# Altium schematic sheet Controller.SchDoc
size A4; Date: Date; CompanyName: HESSO; Engineer: Name; Address1: Route du Rawyl 47; Address2: 1950 Sion; Address3: Switzerland; DocumentNumber: 3; SheetNumber: 1; SheetTotal: 4; ProjectName: Project Name
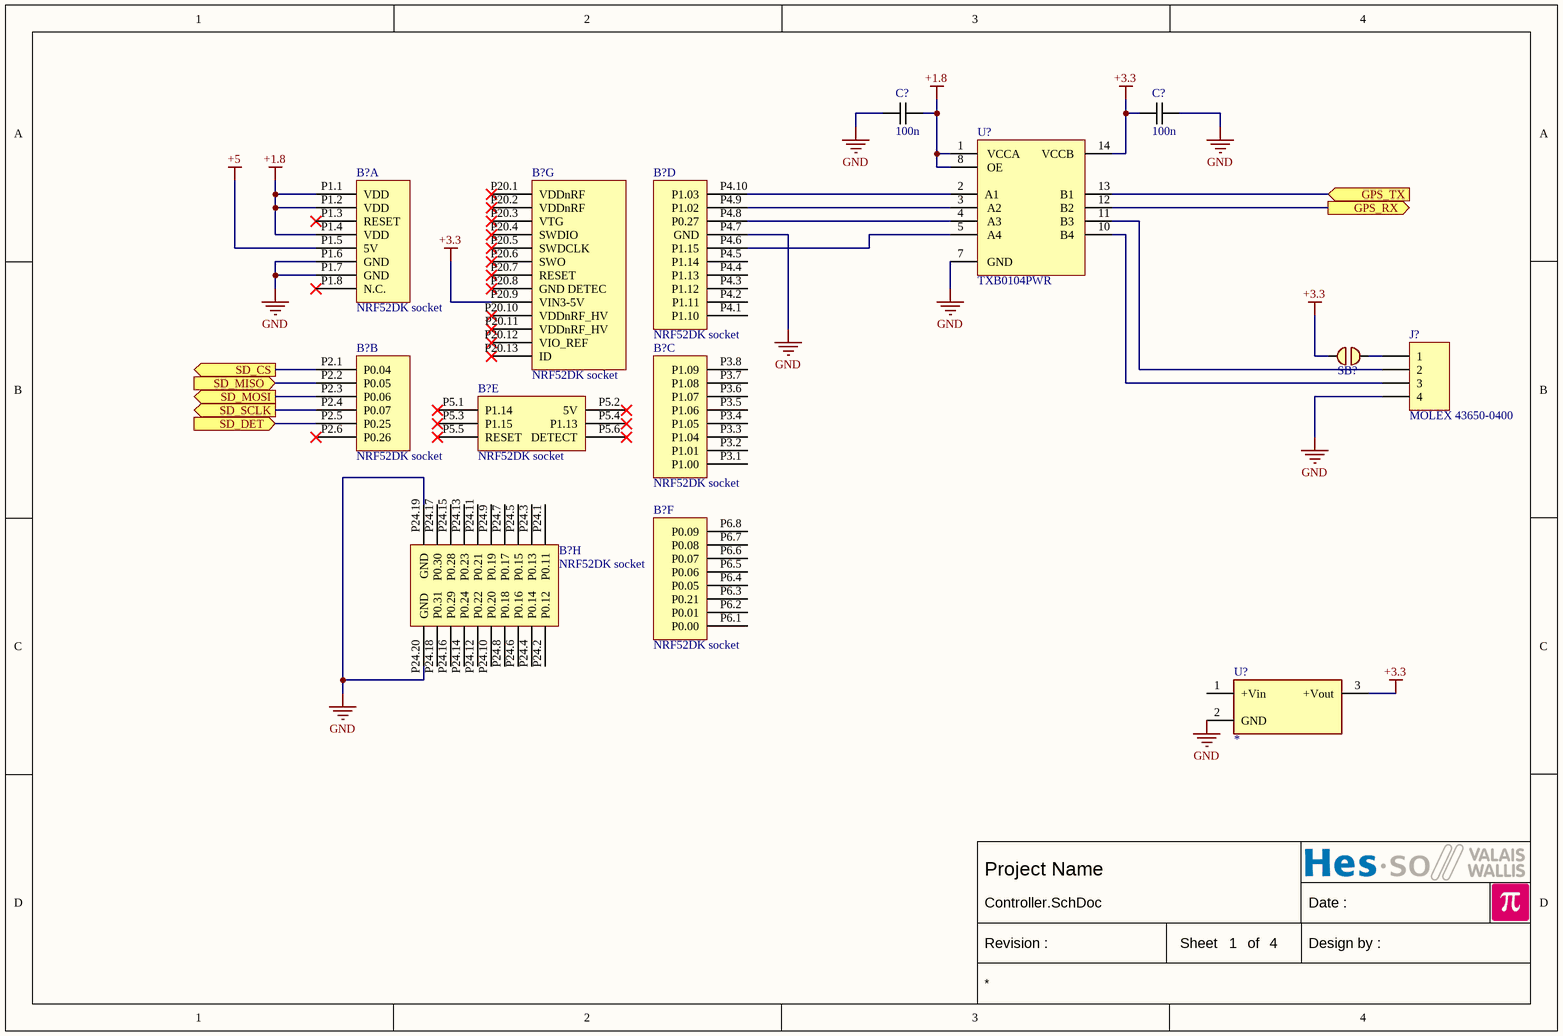
[diagram p0: Controller.SchDoc]

## Parts
(Parts that share a designator on the sheet are numbered #1, #2 ... from top to bottom, then left to right.)
B?#1  NRF52DK socket  [nRF5340DK SOCKET]  (part A of 8)
B?#2  NRF52DK socket  [nRF5340DK SOCKET]  (part G of 8)
B?#3  NRF52DK socket  [nRF5340DK SOCKET]  (part D of 8)
B?#4  NRF52DK socket  [nRF5340DK SOCKET]  (part B of 8)
B?#5  NRF52DK socket  [nRF5340DK SOCKET]  (part E of 8)
B?#6  NRF52DK socket  [nRF5340DK SOCKET]  (part C of 8)
B?#7  NRF52DK socket  [nRF5340DK SOCKET]  (part H of 8)
B?#8  NRF52DK socket  [nRF5340DK SOCKET]  (part F of 8)
C?#1  100n  [CAPACITOR 1608 REFLOW]
C?#2  100n  [CAPACITOR 1608 REFLOW]
J?  MOLEX 43650-0400  [MOLEX 43650-0400]
SB?  *  [Solder Bridge 1mm Unconnected]  (value not drawn)  (net tie, no BOM)
U?#1  TXB0104PWR  [TSSOP14 P0.65 C4.4x5.0 H1.1]
U?#2  *  [TRACO TSR 1]

## Ports
GPS_RX (out), GPS_TX (in), SD_CS (out), SD_DET (in), SD_MISO (in), SD_MOSI (out), SD_SCLK (out)

## Nets
+1.8: B?#1.P1.1(VDD) B?#1.P1.2(VDD) B?#1.P1.4(VDD) C?#1.1 U?#1.1(VCCA) U?#1.8(OE)
+3.3: B?#2.P20.9(VIN3-5V) C?#2.2 SB?.2 U?#1.14(VCCB) U?#2.3(+Vout)
+5: B?#1.P1.5(5V)
GND: B?#1.P1.6(GND) B?#1.P1.7(GND) B?#3.P4.7(GND) B?#7.P24.19(GND) B?#7.P24.20(GND) C?#1.2 C?#2.1 J?.4 U?#1.7(GND) U?#2.2(GND)
GPS_RX: U?#1.12(B2) ; port GPS_RX
GPS_TX: U?#1.13(B1) ; port GPS_TX
SD_CS: B?#4.P2.1(P0.04) ; port SD_CS
SD_DET: B?#4.P2.5(P0.25) ; port SD_DET
SD_MISO: B?#4.P2.2(P0.05) ; port SD_MISO
SD_MOSI: B?#4.P2.3(P0.06) ; port SD_MOSI
SD_SCLK: B?#4.P2.4(P0.07) ; port SD_SCLK
NetB?#3_P4.6: B?#3.P4.6(P1.15) U?#1.5(A4)
NetB?#3_P4.8: B?#3.P4.8(P0.27) U?#1.4(A3)
NetB?#3_P4.9: B?#3.P4.9(P1.02) U?#1.3(A2)
NetB?#3_P4.10: B?#3.P4.10(P1.03) U?#1.2(A1)
NetJ?_1: J?.1 SB?.1
NetJ?_2: J?.2 U?#1.11(B3)
NetJ?_3: J?.3 U?#1.10(B4)

Not connected (* = marked no-connect by the designer): B?#1 P1.3(RESET)* P1.8(N.C.)*; B?#2 P20.1(VDDnRF)* P20.2(VDDnRF)* P20.3(VTG)* P20.4(SWDIO)* P20.5(SWDCLK)* P20.6(SWO)* P20.7(RESET)* P20.8(GND_DETEC)* P20.10(VDDnRF_HV)* P20.11(VDDnRF_HV)* P20.12(VIO_REF)* P20.13(ID)*; B?#3 P4.1(P1.10) P4.2(P1.11) P4.3(P1.12) P4.4(P1.13) P4.5(P1.14); B?#4 P2.6(P0.26)*; B?#5 P5.1(P1.14)* P5.2(5V)* P5.3(P1.15)* P5.4(P1.13)* P5.5(RESET)* P5.6(DETECT)*; B?#6 P3.1(P1.00) P3.2(P1.01) P3.3(P1.04) P3.4(P1.05) P3.5(P1.06) P3.6(P1.07) P3.7(P1.08) P3.8(P1.09); B?#7 P24.1(P0.11) P24.2(P0.12) P24.3(P0.13) P24.4(P0.14) P24.5(P0.15) P24.6(P0.16) P24.7(P0.17) P24.8(P0.18) P24.9(P0.19) P24.10(P0.20) P24.11(P0.21) P24.12(P0.22) P24.13(P0.23) P24.14(P0.24) P24.15(P0.28) P24.16(P0.29) P24.17(P0.30) P24.18(P0.31); B?#8 P6.1(P0.00) P6.2(P0.01) P6.3(P0.21) P6.4(P0.05) P6.5(P0.06) P6.6(P0.07) P6.7(P0.08) P6.8(P0.09); U?#2 1(+Vin)

## Notes on the sheet
- Date :
- Revision :
- Sheet
- of
- Design by :

## Library data of the parts
B?#1-B?#8 = nRF5340DK Socket: nRF53 development kit; Value: NRF52DK socket
C?#1 C?#2 = Capacitor: Value: *
J? = MOLEX 43650-0400: Micro-Fit 3.0 Right-Angle Header, 3.00mm Pitch, Single Row, 4 Circuits
SB? = Solderbridge Unconnected: Value: *
U?#1 = TXB0104PWR: 4-Bit Bidirectional Voltage-Level Translator With utomatic Direction Sensing and ±15-kV ESD Protection; Value: TXB0104PWR
U?#2 = TRACO TSR 1: DC/DC Converter; Value: *